# EAGLE schematic etchctrl (EAGLE 6.6.0)
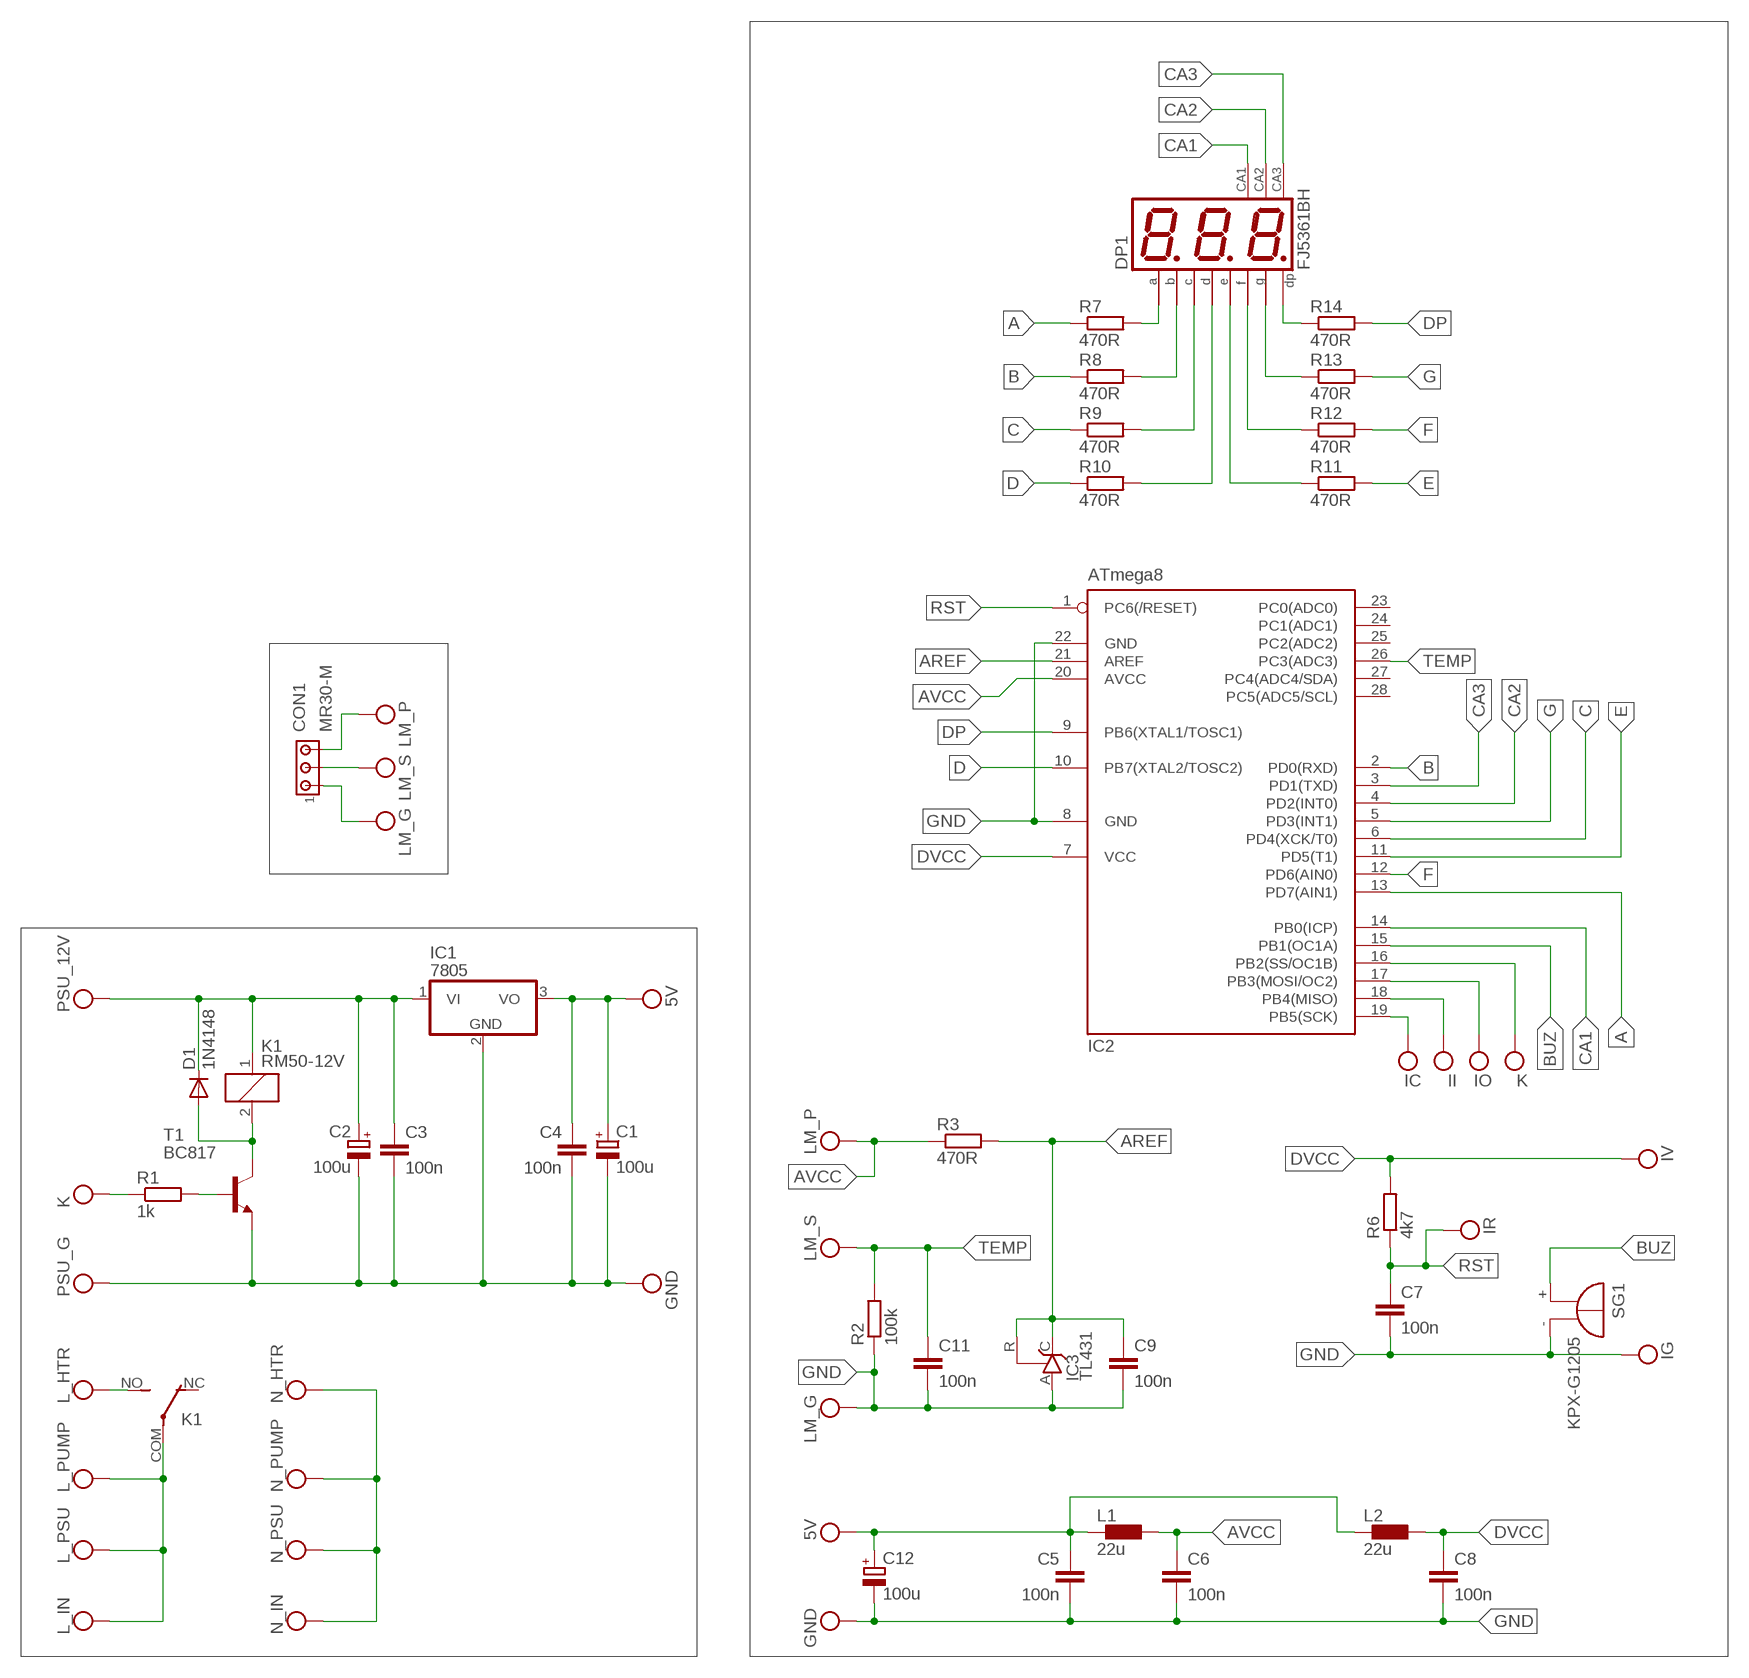
[diagram p0: schematic, sheet 1]

## Parts
C1  100u  CPOL-EU085CS-1AR  [085CS_1AR]
C2  100u  CPOL-EU085CS-1AR  [085CS_1AR]
C3  100n  C2,5-3  [C2.5-3]
C4  100n  C2,5-3  [C2.5-3]
C5  100n  C2,5-3  [C2.5-3]
C6  100n  C2,5-3  [C2.5-3]
C7  100n  C2,5-3  [C2.5-3]
C8  100n  C2,5-3  [C2.5-3]
C9  100n  C2,5-3  [C2.5-3]
C11  100n  C2,5-3  [C2.5-3]
C12  100u  CPOL-EU085CS-1AR  [085CS_1AR]
CON1  MR30-M  MTA03-100  [10X03MTA]
D1  1N4148  1N4148DO35-7  [DO35-7]
DP1  FJ5361BH  BA56-12EWA  [BX56-12]
IC1  7805  786TV  [TO220V]
IC2  ATmega8  MEGA8-P  [DIL28-3]
IC3  TL431  TL431CLP  [TO92-CLP]
K1  RM50-12V  APF30212C  [APF30212C]
L1  22u  L  [L1812]
L2  22u  L  [L1812]
R1  1k  R  [R0805]
R2  100k  R  [R0805]
R3  470R  R  [R0805]
R6  4k7  R  [R0805]
R7  470R  R  [R0805]
R8  470R  R  [R0805]
R9  470R  R  [R0805]
R10  470R  R  [R0805]
R11  470R  R  [R0805]
R12  470R  R  [R0805]
R13  470R  R  [R0805]
R14  470R  R  [R0805]
SG1  KPX-G1205  F/EB20P  [F/EB20P]
T1  BC817  -NPN-SOT23-EBC  [SOT23-EBC]

## Nets
A: IC2.13(PD7(AIN1)) R7.1
AREF: C9.1 IC2.21(AREF) IC3.C IC3.R R3.2
AVCC: C6.1 IC2.20(AVCC) L1.1 R3.1 ; supply symbol labelled LM_P
B: IC2.2(PD0(RXD)) R8.1
BUZ: IC2.15(PB1(OC1A)) SG1.+
C: IC2.6(PD4(XCK/T0)) R9.1
CA1: DP1.12(CA) IC2.14(PB0(ICP))
CA2: DP1.9(CA) IC2.4(PD2(INT0))
CA3: DP1.8(CA) IC2.3(PD1(TXD))
D: IC2.10(PB7(XTAL2/TOSC2)) R10.1
DP: IC2.9(PB6(XTAL1/TOSC1)) R14.2
DVCC: C8.1 IC2.7(VCC) L2.1 R6.2 ; supply symbol labelled IV
E: IC2.11(PD5(T1)) R11.2
F: IC2.12(PD6(AIN0)) R12.2
G: IC2.5(PD3(INT1)) R13.2
GND: C5.2 C6.2 C7.2 C8.2 C9.2 C11.2 C12.- IC2.8(GND) IC2.22(GND) IC3.A R2.1 SG1.- ; supply symbol labelled LM_G, IG
N$1: D1.A K1.2 T1.C
N$2: R1.2 T1.B
N$4: DP1.11(A) R7.2
N$5: DP1.7(B) R8.2
N$6: DP1.4(C) R9.2
N$7: DP1.2(D) R10.2
N$8: DP1.1(E) R11.1
N$9: DP1.10(F) R12.1
N$10: DP1.3(DP) R14.1
N$11: DP1.5(G) R13.1
RST: C7.1 IC2.1(PC6(/RESET)) R6.1 ; supply symbol labelled IR
TEMP: C11.1 IC2.26(PC3(ADC3)) R2.2 ; supply symbol labelled LM_S
VCC: C1.+ C1.- C2.+ C2.- C3.1 C3.2 C4.1 C4.2 C5.1 C12.+ CON1.1 CON1.2 CON1.3 D1.C IC1.1(VI) IC1.2(GND) IC1.3(VO) IC2.16(PB2(SS/OC1B)) IC2.17(PB3(MOSI/OC2)) IC2.18(PB4(MISO)) IC2.19(PB5(SCK)) K1.1 K1.COM(2:P) K1.NO(2:S) L1.2 L2.2 R1.1 T1.E ; supply symbol labelled L_HTR, L_IN, L_PUMP, L_PSU, N_IN, N_HTR, N_PUMP, N_PSU, PSU_12V, PSU_G, GND, K, 5V, LM_G, LM_S, LM_P, IC, II, IO
Unconnected: IC2.23(PC0(ADC0)) IC2.24(PC1(ADC1)) IC2.25(PC2(ADC2)) IC2.27(PC4(ADC4/SDA)) IC2.28(PC5(ADC5/SCL)) K1.NC(2:O)

## Library data of the parts
C1 C2 C12 = rcl:CPOL-EU: POLARIZED CAPACITOR, European symbol
C3-C9 C11 = capacitor-wima:C: CAPACITOR naming: grid - package width
CON1 = con-amp:MTA03-100: AMP connector
D1 = diode:1N4148: DIODE high speed (Philips)
DP1 = display-kingbright:B?56-12*WA: 14.22mm (0.56INCH) THREE DIGIT NUMERIC DISPLAY Source: http://www.kingbright.com .. BA56-11EWA(Ver1189474895.pdf; OC_FARNELL: unknown; OC_NEWARK: unknown
IC1 = linear:78*: Positive VOLTAGE REGULATOR Source: http://cache.national.com/ds/LM/LM78L05.pdf http://www.fairchildsemi.com/ds/LM/LM7805.pdf
IC2 = atmel:MEGA8-P: MICROCONTROLLER 8 Kbytes FLASH, 1 kbytes SRAM, 512 bytes EEPROM, USART, 4-channel 10 bit ADC, 2-channel 8 bit ADC Pin compatible with Atmega48, ATMega88, ATMega168 Source: avr.lbr; OC_FARNELL: unknown; OC_NEWARK: unknown
IC3 = v-reg:TL431CLP: VOLTAGE REGULATOR
K1 = relay:APF30212C: Compliant with European standards 1a/1c 6A Slim power relays Source: Data sheet <http://pewa.panasonic.com/assets/pcsd/catalog/pf-catalog.pdf>; OC_FARNELL: unknown
L1 L2 = eagle-ltspice:L: INDUCTOR, European symbol; SPICEMODEL: NONE; SPICEPREFIX: L
R1-R3 R6-R14 = eagle-ltspice:R: RESISTOR, European symbol; SPICEMODEL: NONE; SPICEPREFIX: R
SG1 = buzzer:F/EB20P: BUZZER Source: Buerklin; OC_FARNELL: unknown; OC_NEWARK: unknown
T1 = transistor:*-NPN-: NPN Transistror BF959 corrected 2008.03.06